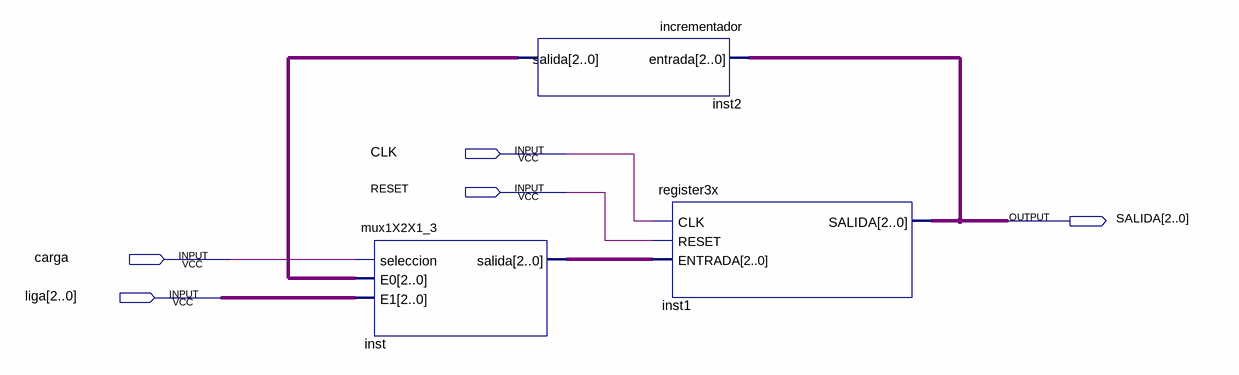
[diagram p0: schematic sheet]
// Quartus schematic contador.bdf as structural Verilog: 3 symbols, 5 pins
module contador (
  input  CLK,
  input  RESET,
  input  carga,
  input  [2:0] liga,
  output [2:0] SALIDA
);

  wire [2:0] inst2_salida, inst_salida;

  mux1X2X1_3 inst (.seleccion(carga), .E0(inst2_salida), .E1(liga), .salida(inst_salida));
  incrementador inst2 (.entrada(SALIDA), .salida(inst2_salida));
  register3x inst1 (.CLK(CLK), .RESET(RESET), .ENTRADA(inst_salida), .SALIDA(SALIDA));
endmodule
